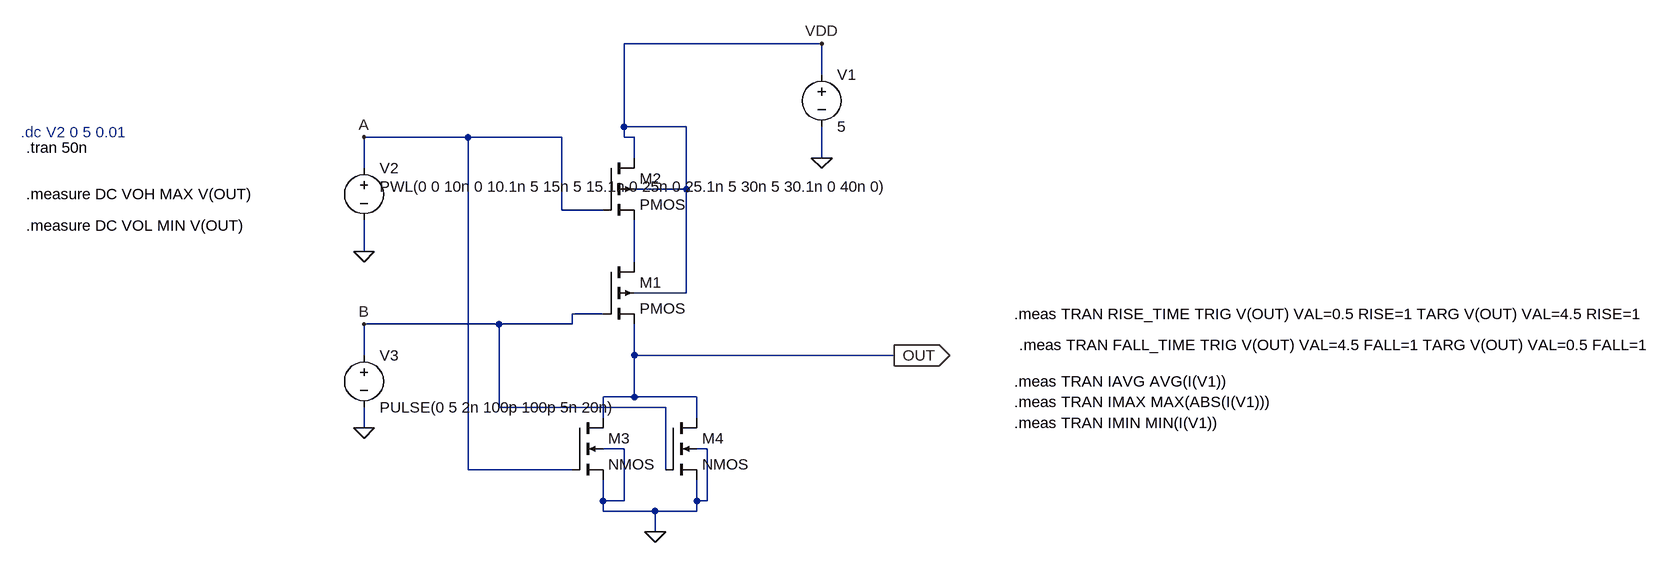
[diagram p0: schematic cmos_nor.asc]
cmos_nor.asc, the LTspice schematic file:
Version 4.1
SHEET 1 1932 680
WIRE 624 -288 320 -288
WIRE 624 -240 624 -288
WIRE 320 -160 320 -288
WIRE 416 -160 320 -160
WIRE 80 -144 -80 -144
WIRE 224 -144 80 -144
WIRE 320 -144 320 -160
WIRE 336 -144 320 -144
WIRE 336 -112 336 -144
WIRE 624 -112 624 -160
WIRE -80 -96 -80 -144
WIRE 416 -64 416 -160
WIRE 416 -64 336 -64
WIRE 224 -32 224 -144
WIRE 288 -32 224 -32
WIRE -80 32 -80 -16
WIRE 336 48 336 -16
WIRE 416 96 416 -64
WIRE 416 96 336 96
WIRE 288 128 240 128
WIRE 128 144 -80 144
WIRE 240 144 240 128
WIRE 240 144 128 144
WIRE -80 192 -80 144
WIRE 336 192 336 144
WIRE 736 192 336 192
WIRE 336 256 336 192
WIRE 336 256 288 256
WIRE 432 256 336 256
WIRE 128 272 128 144
WIRE 384 272 128 272
WIRE 288 288 288 256
WIRE 432 288 432 256
WIRE -80 304 -80 272
WIRE 320 336 288 336
WIRE 448 336 432 336
WIRE 80 368 80 -144
WIRE 240 368 80 368
WIRE 384 368 384 272
WIRE 288 416 288 384
WIRE 320 416 320 336
WIRE 320 416 288 416
WIRE 432 416 432 384
WIRE 448 416 448 336
WIRE 448 416 432 416
WIRE 288 432 288 416
WIRE 368 432 288 432
WIRE 432 432 432 416
WIRE 432 432 368 432
WIRE 368 464 368 432
FLAG 624 -112 0
FLAG -80 32 0
FLAG -80 304 0
FLAG 736 192 OUT
IOPIN 736 192 Out
FLAG -80 -144 A
FLAG -80 144 B
FLAG 624 -288 VDD
FLAG 368 464 0
SYMBOL pmos4 288 48 R0
SYMATTR InstName M1
SYMBOL pmos4 288 -112 R0
SYMATTR InstName M2
SYMBOL nmos4 240 288 R0
SYMATTR InstName M3
SYMBOL nmos4 384 288 R0
SYMATTR InstName M4
SYMBOL voltage 624 -256 R0
SYMATTR InstName V1
SYMATTR Value 5
SYMBOL voltage -80 -112 R0
WINDOW 3 24 44 Left 2
WINDOW 123 0 0 Left 0
WINDOW 39 0 0 Left 0
SYMATTR InstName V2
SYMATTR Value PWL(0 0 10n 0 10.1n 5 15n 5 15.1n 0 25n 0 25.1n 5 30n 5 30.1n 0 40n 0)
SYMBOL voltage -80 176 R0
WINDOW 123 0 0 Left 0
WINDOW 39 0 0 Left 0
SYMATTR InstName V3
SYMATTR Value PULSE(0 5 2n 100p 100p 5n 20n)
TEXT -608 -152 Left 2 ;.dc V2 0 5 0.01
TEXT -600 -56 Left 2 !.measure DC VOH MAX V(OUT)
TEXT -600 -8 Left 2 !.measure DC VOL MIN V(OUT)
TEXT -600 -128 Left 2 !.tran 50n
TEXT 920 128 Left 2 !.meas TRAN RISE_TIME TRIG V(OUT) VAL=0.5 RISE=1 TARG V(OUT) VAL=4.5 RISE=1
TEXT 928 176 Left 2 !.meas TRAN FALL_TIME TRIG V(OUT) VAL=4.5 FALL=1 TARG V(OUT) VAL=0.5 FALL=1
TEXT 920 232 Left 2 !.meas TRAN IAVG AVG(I(V1))
TEXT 920 264 Left 2 !.meas TRAN IMAX MAX(ABS(I(V1)))
TEXT 920 296 Left 2 !.meas TRAN IMIN MIN(I(V1))

The netlist it stands for:
* cmos_nor.asc
M1 N001 B OUT VDD PMOS
M2 VDD A N001 VDD PMOS
M3 OUT A 0 0 NMOS
M4 OUT B 0 0 NMOS
V1 VDD 0 5
V2 A 0 PWL(0 0 10n 0 10.1n 5 15n 5 15.1n 0 25n 0 25.1n 5 30n 5 30.1n 0 40n 0)
V3 B 0 PULSE(0 5 2n 100p 100p 5n 20n)
.model NMOS NMOS
.model PMOS PMOS
.lib standard.mos
* .dc V2 0 5 0.01
.measure DC VOH MAX V(OUT)
.measure DC VOL MIN V(OUT)
.tran 50n
.meas TRAN RISE_TIME TRIG V(OUT) VAL=0.5 RISE=1 TARG V(OUT) VAL=4.5 RISE=1
.meas TRAN FALL_TIME TRIG V(OUT) VAL=4.5 FALL=1 TARG V(OUT) VAL=0.5 FALL=1
.meas TRAN IAVG AVG(I(V1))
.meas TRAN IMAX MAX(ABS(I(V1)))
.meas TRAN IMIN MIN(I(V1))
.backanno
.end

* Results of the author's LTspice run, read from the files saved beside the schematic
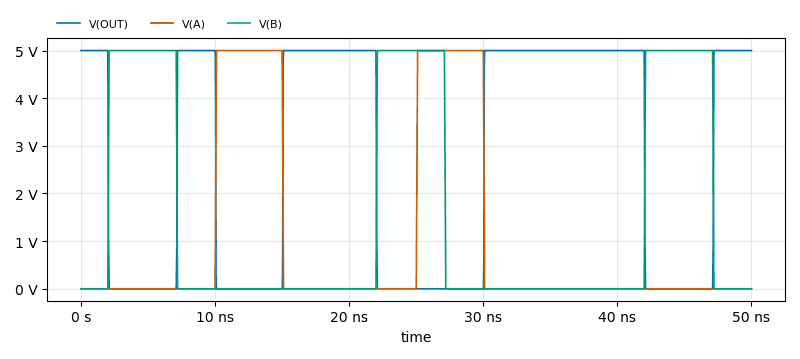
[diagram p1: Transient Analysis of cmos_nor.asc, plotted from the saved traces]
* Transient Analysis, 1 run:
*   V(OUT): min 0 V, max 5.003 V, average 2.672 V, rms 3.651 V, last 5 V
*   V(A): min 0 V, max 5 V, average 1 V, rms 2.229 V, last 0 V
*   V(B): min 0 V, max 5 V, average 1.53 V, rms 2.759 V, last 0 V